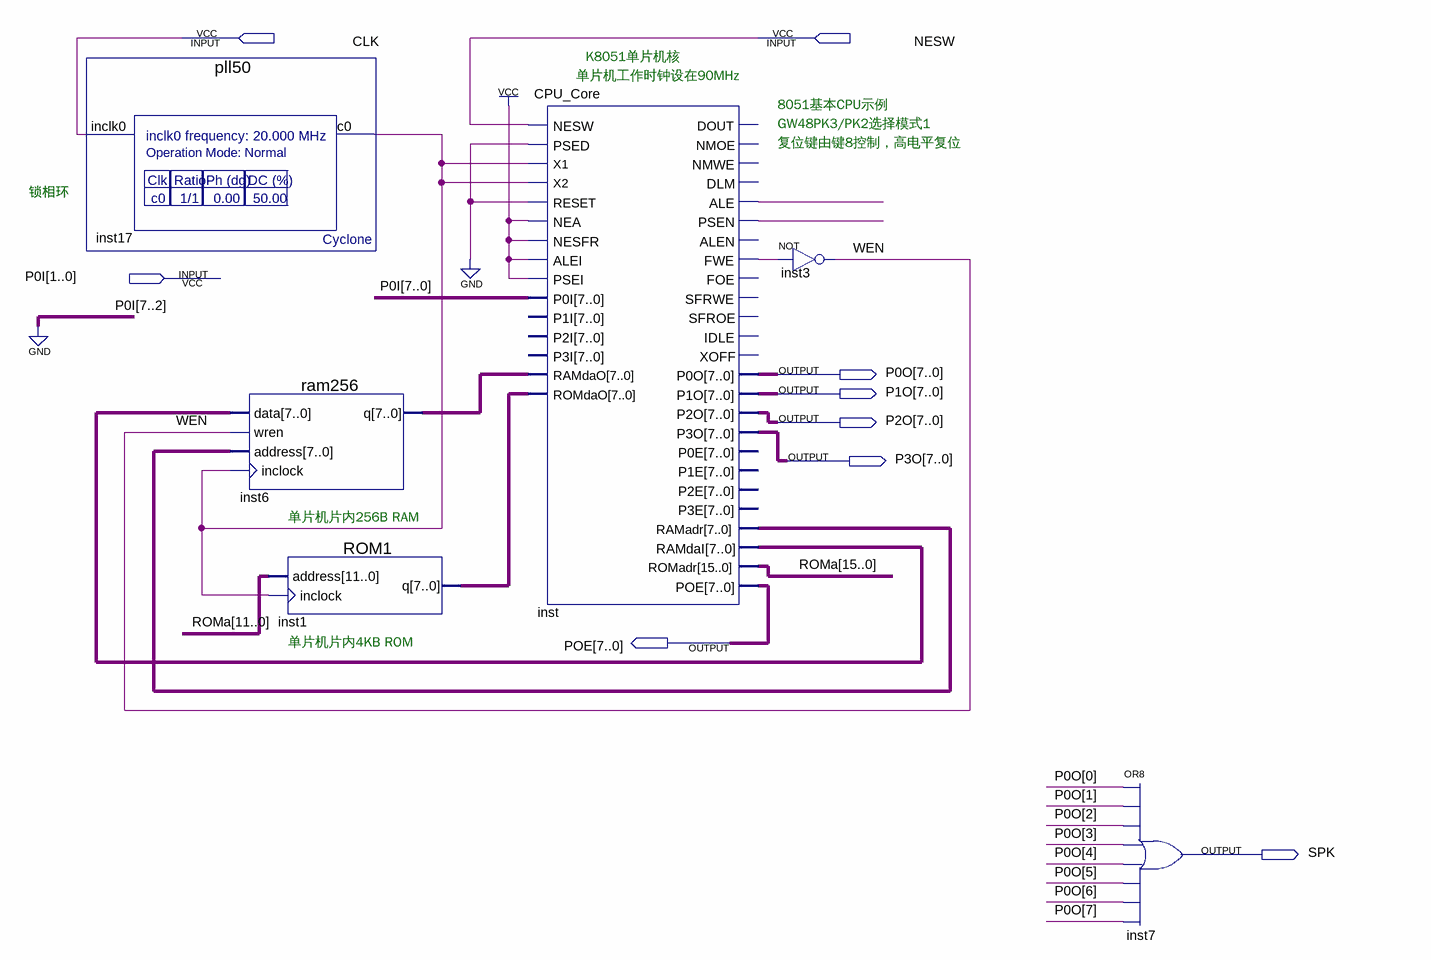
[diagram p0: schematic sheet]
// Quartus schematic MCU8951.bdf as structural Verilog: 6 symbols, 9 pins
module MCU8951 (
  input  CLK,
  input  NESW,
  input  [1:0] P0I,
  output [7:0] P0O,
  output [7:0] P1O,
  output [7:0] P2O,
  output [7:0] P3O,
  output [7:0] POE,
  output SPK
);

  wire inst17_c0, inst_ale, inst_fwe, inst_psen, WEN;
  wire [7:0] inst1_q, inst6_q, inst_ramadr, inst_ramdai;
  wire [15:0] ROMa;

  pll50 inst17 (.inclk0(CLK), .c0(inst17_c0));
  ram256 inst6 (.data(inst_ramdai), .wren(WEN), .address(inst_ramadr), .inclock(inst17_c0), .q(inst6_q));
  ROM1 inst1 (.address(ROMa[11:0]), .inclock(inst17_c0), .q(inst1_q));
  CPU_Core inst (
    .NESW(NESW), .PSED(1'b0), .X1(inst17_c0), .X2(inst17_c0), .RESET(1'b0), .NEA(1'b1), .NESFR(1'b1),
    .ALEI(1'b1), .PSEI(1'b1), .P0I({{6{1'b0}}, P0I}), .RAMdaO(inst6_q), .ROMdaO(inst1_q), .ALE(inst_ale),
    .PSEN(inst_psen), .FWE(inst_fwe), .P0O(P0O), .P1O(P1O), .P2O(P2O), .P3O(P3O), .RAMadr(inst_ramadr),
    .RAMdaI(inst_ramdai), .ROMadr(ROMa), .POE(POE));  // open: P1I, P2I, P3I, DOUT, NMOE, NMWE, DLM, ALEN, FOE, SFRWE, SFROE, IDLE, XOFF, P0E, P1E, P2E, P3E
  not inst3 (WEN, inst_fwe);
  or inst7 (SPK, P0O[0], P0O[1], P0O[2], P0O[3], P0O[4], P0O[5], P0O[6], P0O[7]);

  // Notes on the sheet:
  //   K8051单片机核
  //   单片机工作时钟设在90MHz
  //   8051基本CPU示例
  //   GW48PK3/PK2选择模式1
  //   复位键由键8控制，高电平复位
  //   锁相环
  //   单片机片内256B RAM
  //   单片机片内4KB ROM
endmodule
